# Altium schematic sheet old_IMU.SchDoc
size A4; SheetNumber: 4; SheetTotal: 6
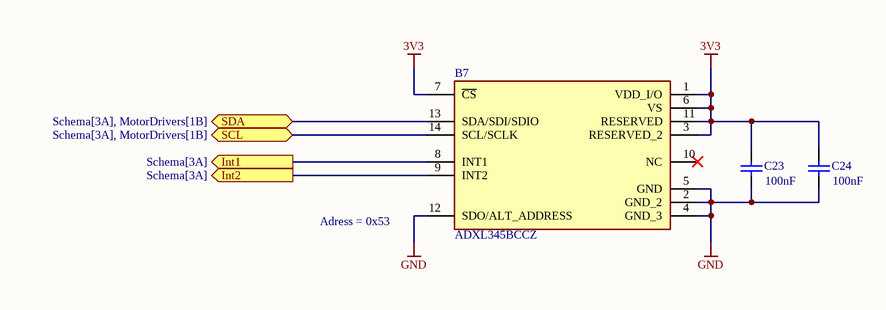
[diagram p0: old_IMU.SchDoc]

## Parts
B7  ADXL345BCCZ  [LGA14R80P3X6_300X500X100]
C23  value 100nF  [6-0805_N]  (hidden comment: Cap)
C24  value 100nF  [6-0805_N]  (hidden comment: Cap)

## Ports
Int1 (out, see Schema[3A]), Int2 (out, see Schema[3A]), SCL (bidir, see Schema[3A], MotorDrivers[1B]), SDA (bidir, see Schema[3A], MotorDrivers[1B])

## Nets
3V3: B7.1(VDD_I/O) B7.3(RESERVED_2) B7.6(VS) B7.7(~{CS}) B7.11(RESERVED) C23.1 C24.1
GND: B7.2(GND_2) B7.4(GND_3) B7.5(GND) B7.12(SDO/ALT_ADDRESS) C23.2 C24.2
Int1: B7.8(INT1) ; port Int1
Int2: B7.9(INT2) ; port Int2
SCL: B7.14(SCL/SCLK) ; port SCL
SDA: B7.13(SDA/SDI/SDIO) ; port SDA

Not connected (* = marked no-connect by the designer): B7 10(NC)*

## Notes on the sheet
- Adress = 0x53

## Library data of the parts
B7 = ADXL345BCCZ: ADXL345BCCZ, Accelerometer 3-Axis, 0.1  3200 Hz 2  3.6 V, 14-Pin LGA; Manufacturer_Name: Analog Devices; Mouser Part Number: N/A; Mouser Price/Stock: https://www.mouser.co.uk/ProductDetail/Analog-Devices/ADXL345BCCZ?qs=WIvQP4zGanhoa7YOkGtvEg%3D%3D; Manufacturer_Part_Number: ADXL345BCCZ; Datasheet Link: http://componentsearchengine.com/Datasheets/1/ADXL345BCCZ.pdf
C23 C24 = Cap: Capacitor; Published: 8-Jun-2000; LatestRevisionDate: 17-Jul-2002; LatestRevisionNote: Re-released for DXP Platform.; PackageReference: RAD-0.3; Publisher: Altium Limited; PackageDescription: Radial Cap, Thru-Hole; 2 Leads; 0.3 in Pin Spacing